# EAGLE design PowerBoard1AMp (EAGLE 7.3.0)
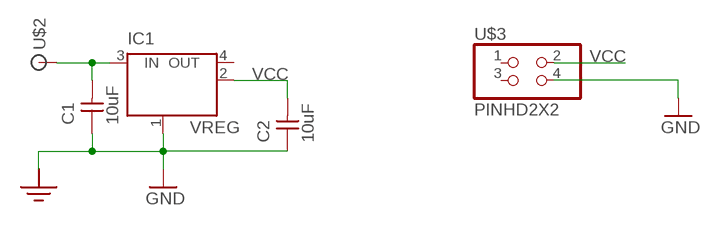
[diagram p0: schematic, sheet 1]

## Parts
C1  10uF  UNPOLARIZED_CAPACITOR1206  [1206]
C2  10uF  UNPOLARIZED_CAPACITOR1206  [1206]
IC1  VREG  MC33269ST-3.3T3  [SOT223]
U$1  GND  [PAD.1]
U$2  SIGNAL  [PAD.1]
U$3  PINHD2X2  PINHD-2X2-SMD  [2X02SMD]

## Nets
GND: C1.1 C2.1 IC1.1(GND/ADJ) U$1.P$1 U$3.4
N$4: C1.2 IC1.3(IN) U$2.P$1
VCC: C2.2 IC1.2(OUT) U$3.2
Unconnected: IC1.4(OUT) U$3.1 U$3.3

## Library data of the parts
C1 C2 = fablab:UNPOLARIZED_CAPACITOR: unpolarized_capacitor
IC1 = fabPatil:MC33269ST*: Adjustable Output Low Dropout Voltage Regulator 800 mA Source: http://www.onsemi.com/pub/Collateral/MC33269-D.PDF
U$1 = ng:GND
U$2 = ng:SIGNAL
U$3 = fabPatil:PINHD-2X2-SMD

## Board
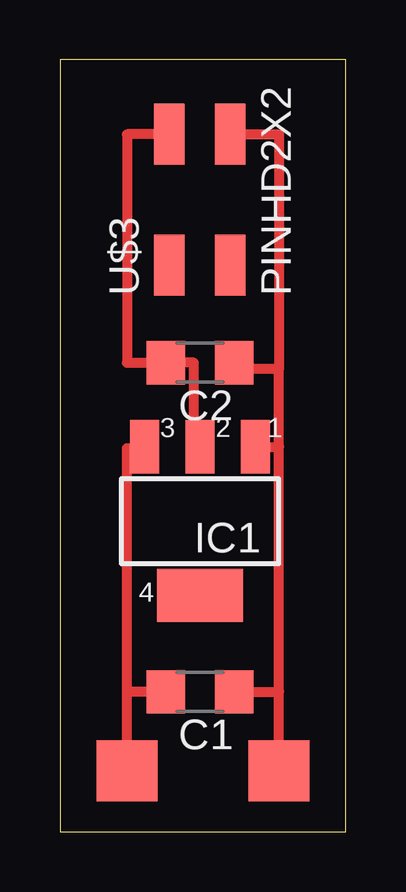
[diagram p1: board, top side]
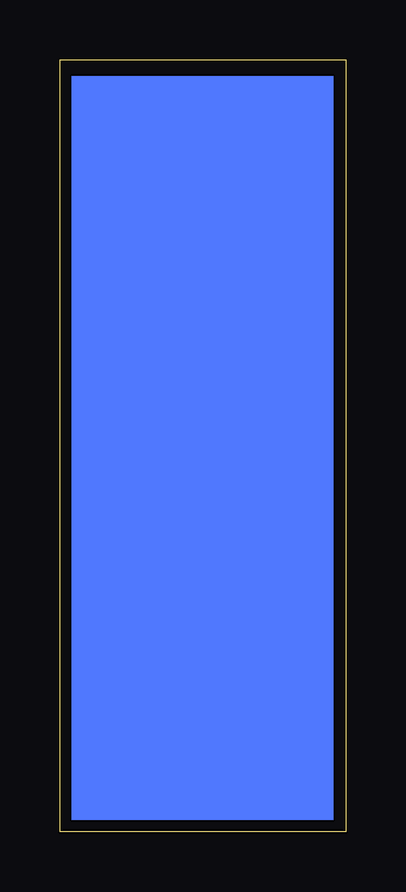
[diagram p2: board, bottom side, seen from below]

Size 11.92 x 32.18 mm. Coordinates in mm from the lower left corner, seen from the top.
Outline: 0,0 11.92,0 11.92,32.18 0,32.18 0,0
Copper layers (1*16): Top 0.035mm / dielectric 1.5mm / Bottom 0.035mm
Design rules "default": minimum track width 10mil, minimum drill 24mil, track to track 8mil, track to pad 8mil, pad to pad 8mil, via to via 8mil, smd to smd 8mil, copper to edge 40mil, drill to drill 8mil, minimum pad ring 10mil, minimum via ring 8mil, stop-mask expansion 4mil, vias tented up to drill 0mil, thermal gap 10mil

### Footprints (pad centres in the part's own frame; a part is rotated, then mirrored left to right if it is on the bottom)
1206 = smd 1.6 x 1.803: 1 -1.422,0; 2 1.422,0
SOT223 = smd 1.219 x 2.235: 1 -2.311,-3.099; 2 0,-3.099; 3 2.311,-3.099 | smd 3.6 x 2.2: 4 0,3.099
PAD.1 = smd 2.54 x 2.54: P$1 0,0
2X02SMD = smd 2.54 x 1.27: 1 -2.54,1.27; 2 2.92,1.27; 3 -2.54,-1.27; 4 2.92,-1.27

### Placement (x,y rotation side)
C1  5.84,5.84 180 top
C2  5.84,19.56 180 top
IC1  5.84,12.95 180 top
U$1  9.14,2.54 0 top
U$2  2.79,2.54 0 top
U$3  5.84,26.16 90 top

### Tracks (layer width: path | path; a pad name or v marks a point on that pad's centre or on a via)
GND
  Top 0.406: U$3.4 9.14,29.08 9.14,19.3 | 9.14,19.3 7.26,19.3 C2.1 | C1.1 9.14,5.84 | 9.14,5.84 9.14,16.05 | 9.14,16.05 9.14,19.3 | IC1.1 9.14,16.05 | 9.14,2.03 U$1.P$1 9.14,5.84
N$4
  Top 0.406: C1.2 2.79,5.84 | 2.79,5.84 2.79,16 3.53,16 IC1.3 | U$2.P$1 2.79,5.84
VCC
  Top 0.406: IC1.2 5.59,16.05 5.59,19.56 C2.2 2.79,19.56 2.79,29.08 U$3.2
(copper drawn outside any net)
  shapes: Bottom area x1